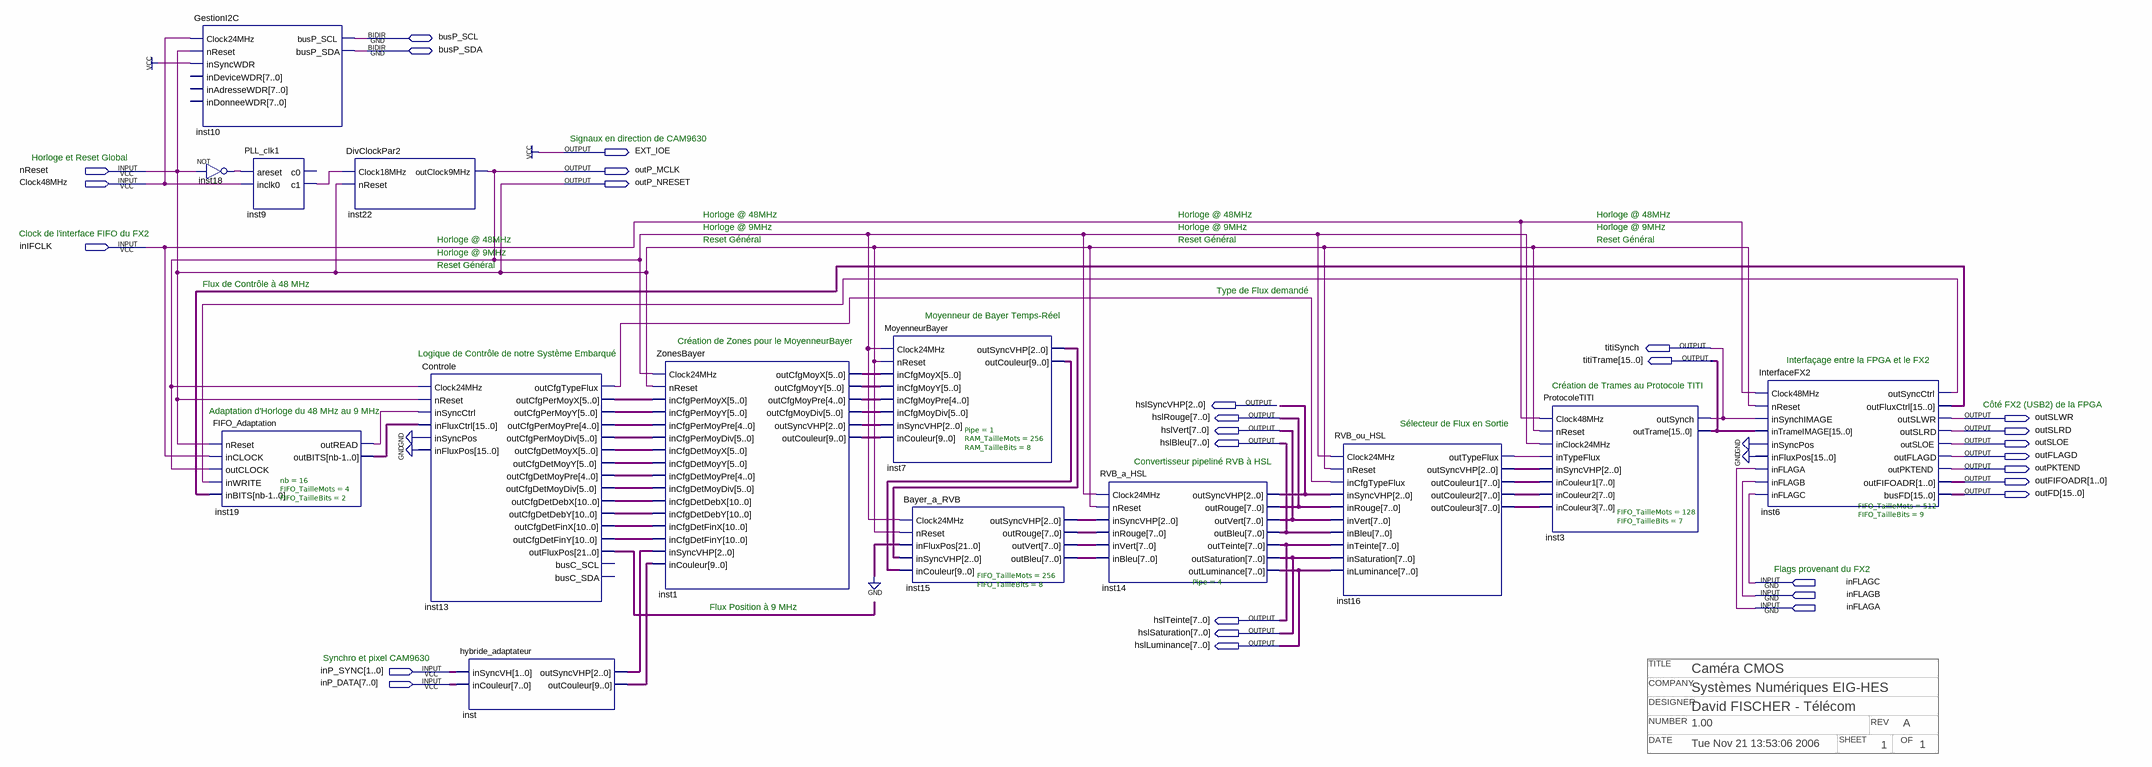
[diagram p0: schematic sheet]
// Quartus schematic Hybride.bdf as structural Verilog: 14 symbols, 29 pins
// Title block: TITLE: Caméra CMOS; COMPANY: Systèmes Numériques EIG-HES; DESIGNER: David FISCHER - Télécom; NUMBER: 1.00; REV: A; DATE: Tue Nov 21 13:53:06 2006; SHEET: 1; OF: 1
module Hybride (
  input  nReset,
  input  Clock48MHz,
  input  inIFCLK,
  input  inFLAGC,
  input  inFLAGB,
  input  inFLAGA,
  input  [1:0] inP_SYNC,
  input  [7:0] inP_DATA,
  inout  busP_SCL,
  inout  busP_SDA,
  output EXT_IOE,
  output outP_MCLK,
  output outP_NRESET,
  output titiSynch,
  output [15:0] titiTrame,
  output [2:0] hslSyncVHP,
  output [7:0] hslRouge,
  output outSLWR,
  output [7:0] hslVert,
  output outSLRD,
  output [7:0] hslBleu,
  output outSLOE,
  output outFLAGD,
  output outPKTEND,
  output [1:0] outFIFOADR,
  output [15:0] outFD,
  output [7:0] hslTeinte,
  output [7:0] hslSaturation,
  output [7:0] hslLuminance
);

  wire inst6_outsyncctrl, inst9_c1, inst13_outcfgtypeflux, inst16_outtypeflux, inst18_out, inst19_outread;
  wire [2:0] inst1_outsyncvhp, inst7_outsyncvhp, inst15_outsyncvhp, inst16_outsyncvhp, inst_outsyncvhp;
  wire [4:0] inst1_outcfgmoypre, inst13_outcfgdetmoypre, inst13_outcfgpermoypre;
  wire [5:0] inst1_outcfgmoydiv, inst1_outcfgmoyx, inst1_outcfgmoyy, inst13_outcfgdetmoydiv,
       inst13_outcfgdetmoyx, inst13_outcfgdetmoyy, inst13_outcfgpermoydiv, inst13_outcfgpermoyx,
       inst13_outcfgpermoyy;
  wire [7:0] inst15_outbleu, inst15_outrouge, inst15_outvert, inst16_outcouleur1, inst16_outcouleur2,
       inst16_outcouleur3;
  wire [9:0] inst1_outcouleur, inst7_outcouleur, inst_outcouleur;
  wire [10:0] inst13_outcfgdetdebx, inst13_outcfgdetdeby, inst13_outcfgdetfinx, inst13_outcfgdetfiny;
  wire [15:0] inst6_outfluxctrl, inst19_outbits;
  wire [21:0] inst13_outfluxpos;

  GestionI2C inst10 (
    .Clock24MHz(Clock48MHz), .nReset(nReset), .inSyncWDR(1'b1), .busP_SCL(busP_SCL), .busP_SDA(busP_SDA));  // open: inDeviceWDR, inAdresseWDR, inDonneeWDR
  not inst18 (inst18_out, nReset);
  PLL_clk1 inst9 (.areset(inst18_out), .inclk0(Clock48MHz), .c1(inst9_c1));  // open: c0
  FIFO_Adaptation #(.nb(16), .FIFO_TailleMots(4), .FIFO_TailleBits(2)) inst19 (
    .nReset(nReset), .inCLOCK(inIFCLK), .outCLOCK(outP_MCLK), .inWRITE(inst6_outsyncctrl),
    .inBITS(inst6_outfluxctrl), .outREAD(inst19_outread), .outBITS(inst19_outbits));
  DivClockPar2 inst22 (.Clock18MHz(inst9_c1), .nReset(nReset), .outClock9MHz(outP_MCLK));
  Controle inst13 (
    .Clock24MHz(outP_MCLK), .nReset(nReset), .inSyncCtrl(inst19_outread), .inFluxCtrl(inst19_outbits),
    .inSyncPos(1'b0), .inFluxPos({16{1'b0}}), .outCfgTypeFlux(inst13_outcfgtypeflux),
    .outCfgPerMoyX(inst13_outcfgpermoyx), .outCfgPerMoyY(inst13_outcfgpermoyy),
    .outCfgPerMoyPre(inst13_outcfgpermoypre), .outCfgPerMoyDiv(inst13_outcfgpermoydiv),
    .outCfgDetMoyX(inst13_outcfgdetmoyx), .outCfgDetMoyY(inst13_outcfgdetmoyy),
    .outCfgDetMoyPre(inst13_outcfgdetmoypre), .outCfgDetMoyDiv(inst13_outcfgdetmoydiv),
    .outCfgDetDebX(inst13_outcfgdetdebx), .outCfgDetDebY(inst13_outcfgdetdeby),
    .outCfgDetFinX(inst13_outcfgdetfinx), .outCfgDetFinY(inst13_outcfgdetfiny), .outFluxPos(inst13_outfluxpos));  // open: busC_SCL, busC_SDA
  hybride_adaptateur inst (
    .inSyncVH(inP_SYNC), .inCouleur(inP_DATA), .outSyncVHP(inst_outsyncvhp), .outCouleur(inst_outcouleur));
  ZonesBayer inst1 (
    .Clock24MHz(outP_MCLK), .nReset(nReset), .inCfgPerMoyX(inst13_outcfgpermoyx),
    .inCfgPerMoyY(inst13_outcfgpermoyy), .inCfgPerMoyPre(inst13_outcfgpermoypre),
    .inCfgPerMoyDiv(inst13_outcfgpermoydiv), .inCfgDetMoyX(inst13_outcfgdetmoyx),
    .inCfgDetMoyY(inst13_outcfgdetmoyy), .inCfgDetMoyPre(inst13_outcfgdetmoypre),
    .inCfgDetMoyDiv(inst13_outcfgdetmoydiv), .inCfgDetDebX(inst13_outcfgdetdebx),
    .inCfgDetDebY(inst13_outcfgdetdeby), .inCfgDetFinX(inst13_outcfgdetfinx),
    .inCfgDetFinY(inst13_outcfgdetfiny), .inSyncVHP(inst_outsyncvhp), .inCouleur(inst_outcouleur),
    .outCfgMoyX(inst1_outcfgmoyx), .outCfgMoyY(inst1_outcfgmoyy), .outCfgMoyPre(inst1_outcfgmoypre),
    .outCfgMoyDiv(inst1_outcfgmoydiv), .outSyncVHP(inst1_outsyncvhp), .outCouleur(inst1_outcouleur));
  MoyenneurBayer #(.Pipe(1), .RAM_TailleMots(256), .RAM_TailleBits(8)) inst7 (
    .Clock24MHz(outP_MCLK), .nReset(nReset), .inCfgMoyX(inst1_outcfgmoyx), .inCfgMoyY(inst1_outcfgmoyy),
    .inCfgMoyPre(inst1_outcfgmoypre), .inCfgMoyDiv(inst1_outcfgmoydiv), .inSyncVHP(inst1_outsyncvhp),
    .inCouleur(inst1_outcouleur), .outSyncVHP(inst7_outsyncvhp), .outCouleur(inst7_outcouleur));
  Bayer_a_RVB #(.FIFO_TailleMots(256), .FIFO_TailleBits(8)) inst15 (
    .Clock24MHz(outP_MCLK), .nReset(nReset), .inFluxPos({22{1'b0}}), .inSyncVHP(inst7_outsyncvhp),
    .inCouleur(inst7_outcouleur), .outSyncVHP(inst15_outsyncvhp), .outRouge(inst15_outrouge),
    .outVert(inst15_outvert), .outBleu(inst15_outbleu));
  RVB_a_HSL #(.Pipe(4)) inst14 (
    .Clock24MHz(outP_MCLK), .nReset(nReset), .inSyncVHP(inst15_outsyncvhp), .inRouge(inst15_outrouge),
    .inVert(inst15_outvert), .inBleu(inst15_outbleu), .outSyncVHP(hslSyncVHP), .outRouge(hslRouge),
    .outVert(hslVert), .outBleu(hslBleu), .outTeinte(hslTeinte), .outSaturation(hslSaturation),
    .outLuminance(hslLuminance));
  RVB_ou_HSL inst16 (
    .Clock24MHz(outP_MCLK), .nReset(nReset), .inCfgTypeFlux(inst13_outcfgtypeflux), .inSyncVHP(hslSyncVHP),
    .inRouge(hslRouge), .inVert(hslVert), .inBleu(hslBleu), .inTeinte(hslTeinte),
    .inSaturation(hslSaturation), .inLuminance(hslLuminance), .outTypeFlux(inst16_outtypeflux),
    .outSyncVHP(inst16_outsyncvhp), .outCouleur1(inst16_outcouleur1), .outCouleur2(inst16_outcouleur2),
    .outCouleur3(inst16_outcouleur3));
  ProtocoleTITI #(.FIFO_TailleMots(128), .FIFO_TailleBits(7)) inst3 (
    .Clock48MHz(inIFCLK), .nReset(nReset), .inClock24MHz(outP_MCLK), .inTypeFlux(inst16_outtypeflux),
    .inSyncVHP(inst16_outsyncvhp), .inCouleur1(inst16_outcouleur1), .inCouleur2(inst16_outcouleur2),
    .inCouleur3(inst16_outcouleur3), .outSynch(titiSynch), .outTrame(titiTrame));
  InterfaceFX2 #(.FIFO_TailleMots(512), .FIFO_TailleBits(9)) inst6 (
    .Clock48MHz(inIFCLK), .nReset(nReset), .inSynchIMAGE(titiSynch), .inTrameIMAGE(titiTrame),
    .inSyncPos(1'b0), .inFluxPos({16{1'b0}}), .inFLAGA(inFLAGA), .inFLAGB(inFLAGB), .inFLAGC(inFLAGC),
    .outSyncCtrl(inst6_outsyncctrl), .outFluxCtrl(inst6_outfluxctrl), .outSLWR(outSLWR), .outSLRD(outSLRD),
    .outSLOE(outSLOE), .outFLAGD(outFLAGD), .outPKTEND(outPKTEND), .outFIFOADR(outFIFOADR), .busFD(outFD));

  assign EXT_IOE = 1'b1;
  assign outP_NRESET = nReset;

  // Notes on the sheet:
  //   Signaux en direction de CAM9630
  //   Horloge et Reset Global
  //   Horloge @ 48MHz
  //   Horloge @ 48MHz
  //   Horloge @ 48MHz
  //   Horloge @ 9MHz
  //   Horloge @ 9MHz
  //   Horloge @ 9MHz
  //   Clock de l'interface FIFO du FX2
  //   Horloge @ 48MHz
  //   Reset Général
  //   Reset Général
  //   Reset Général
  //   Horloge @ 9MHz
  //   Reset Général
  //   Flux de Contrôle à 48 MHz
  //   Type de Flux demandé
  //   Moyenneur de Bayer Temps-Réel
  //   Création de Zones pour le MoyenneurBayer
  //   Logique de Contrôle de notre Système Embarqué
  //   Interfaçage entre la FPGA et le FX2
  //   Création de Trames au Protocole TITI
  //   Côté FX2 (USB2) de la FPGA
  //   Adaptation d'Horloge du 48 MHz au 9 MHz
  //   Sélecteur de Flux en Sortie
  //   Convertisseur pipeliné RVB à HSL
  //   Flags provenant du FX2
  //   Flux Position à 9 MHz
  //   Synchro et pixel CAM9630
endmodule
